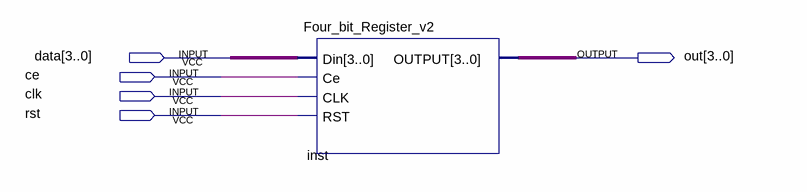
[diagram p0: schematic sheet]
// Quartus schematic four_r.bdf as structural Verilog: 1 symbols, 5 pins
module four_r (
  input  [3:0] data,
  input  ce,
  input  clk,
  input  rst,
  output [3:0] out
);

  Four_bit_Register_v2 inst (.Din(data), .Ce(ce), .CLK(clk), .RST(rst), .OUTPUT(out));
endmodule
